# EasyEDA Pro project kod-01-akdk.eprj, board kod-01-panelized-pcb
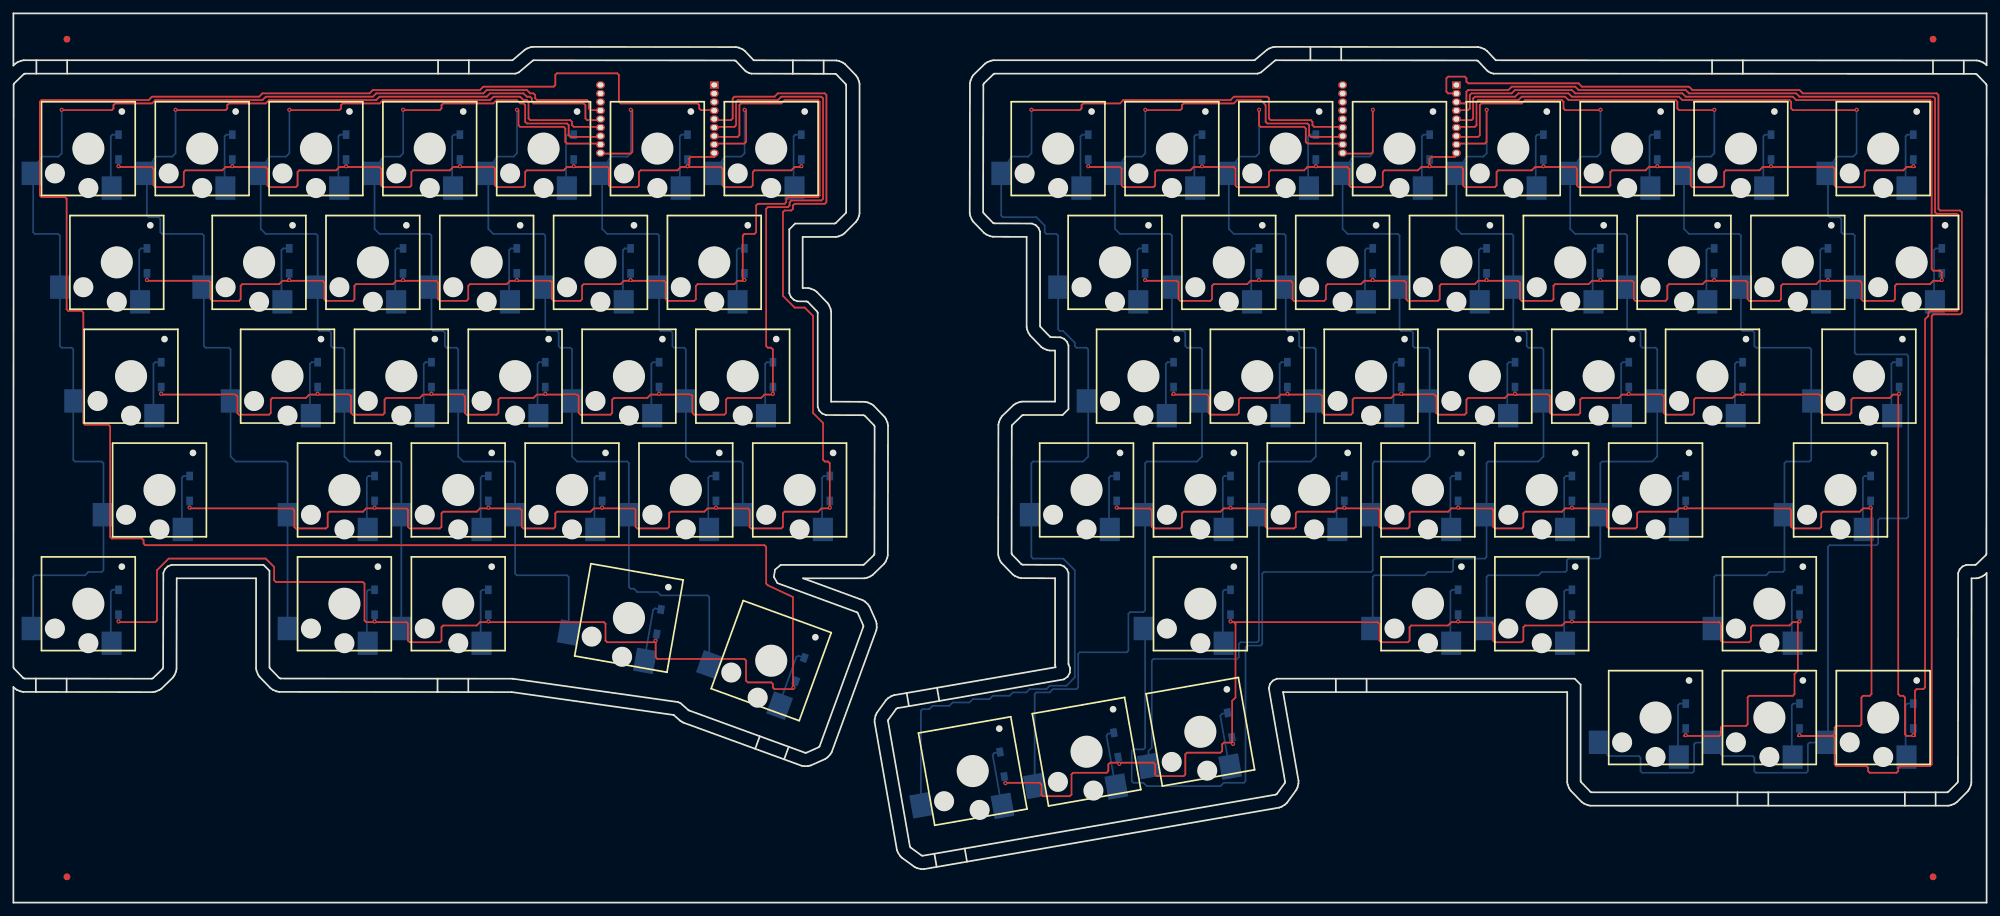
[diagram p4: board, top side]
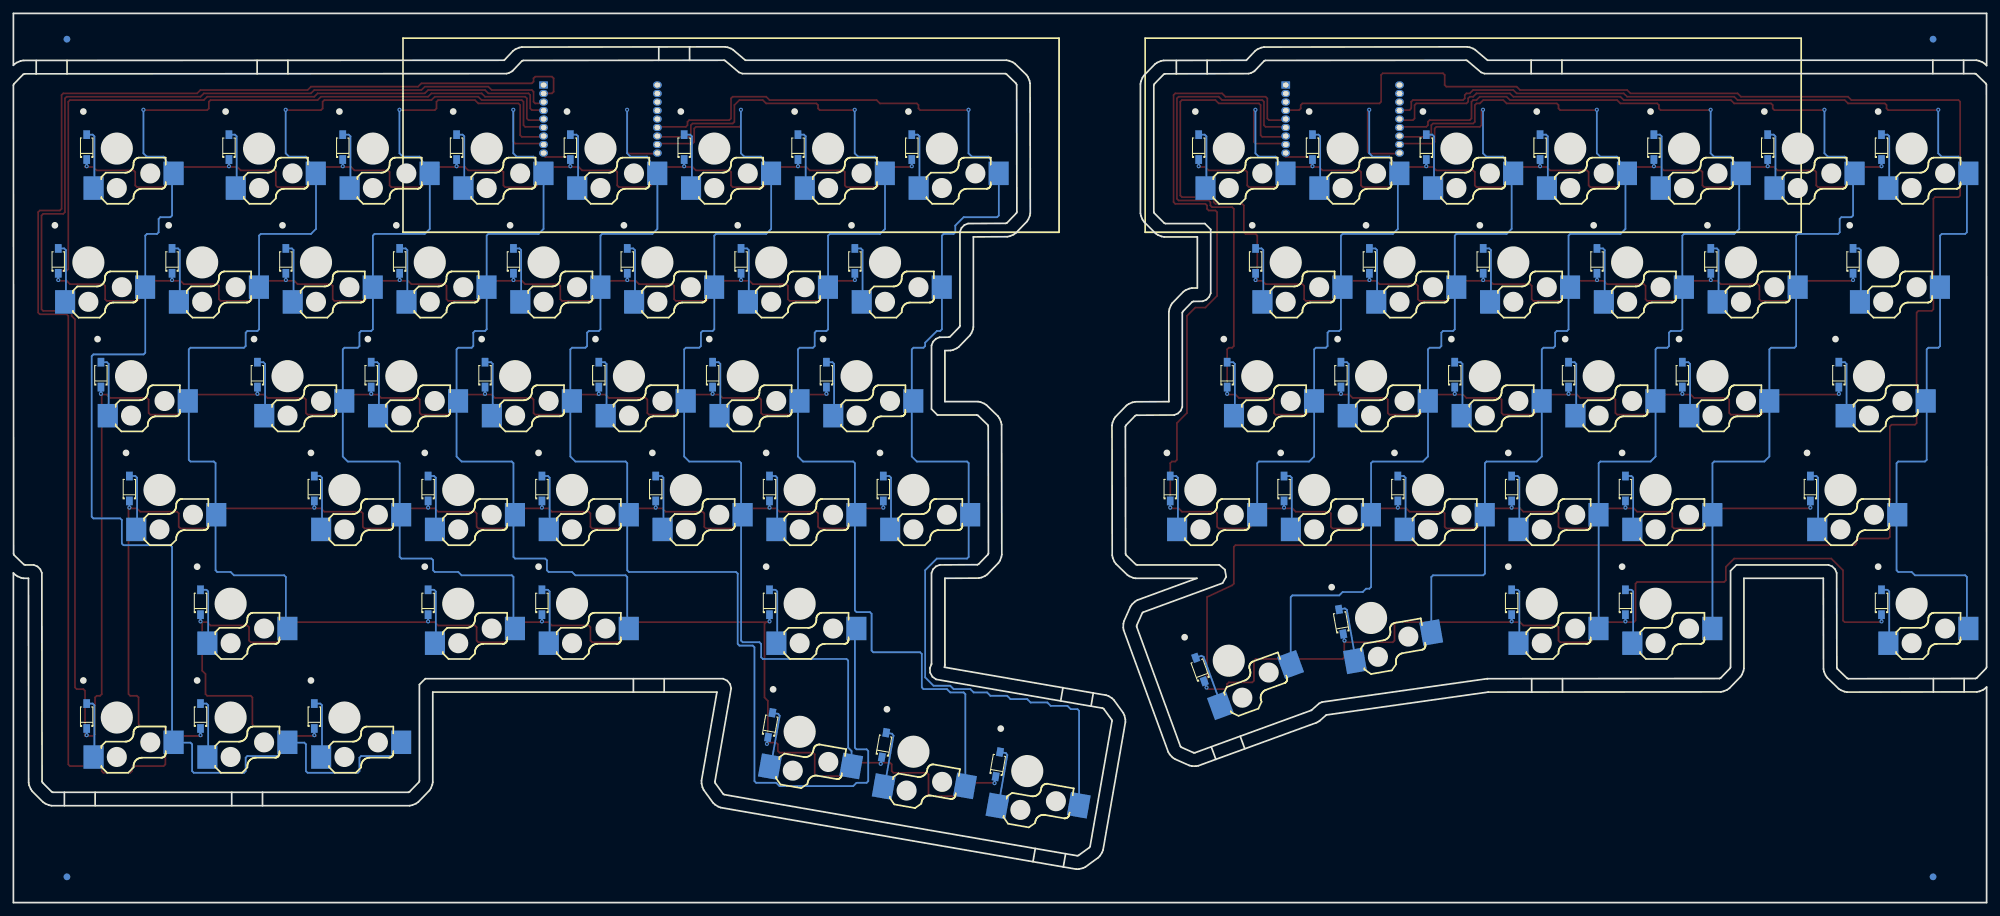
[diagram p5: board, bottom side, seen from below]

Outline 294.76 x 132.85 mm; copper layers: Top Layer, Bottom Layer. Coordinates in mm from the lower left corner of the outline.

## Design rules (mm)
spacing Default (default): track to track 0.152, other pairs 0 to 0.152
track width Default (default): min 0.254, default 0.254, max 25.4
via Default (default): diameter min 0.61, default 0.61, max 100.025; hole min 0.305, default 0.305, max 59.995

## Placement (name value [footprint] x y rotation side)
D1_L  -  [1N4148W]  15.7 112.85 90 bottom
D1_R  -  [1N4148W]  160.56 112.85 90 bottom
D2_L  -  [1N4148W]  32.7 112.85 90 bottom
D2_R  -  [1N4148W]  177.56 112.85 90 bottom
D3_L  -  [1N4148W]  49.7 112.85 90 bottom
D3_R  -  [1N4148W]  194.56 112.85 90 bottom
D4_L  -  [1N4148W]  66.7 112.85 90 bottom
D4_R  -  [1N4148W]  211.56 112.85 90 bottom
D5_L  -  [1N4148W]  83.7 112.85 90 bottom
D5_R  -  [1N4148W]  228.56 112.85 90 bottom
D6_L  -  [1N4148W]  100.7 112.85 90 bottom
D6_R  -  [1N4148W]  245.56 112.85 90 bottom
D7_L  -  [1N4148W]  117.7 112.85 90 bottom
D7_R  -  [1N4148W]  262.56 112.85 90 bottom
D8_L  -  [1N4148W]  19.95 95.85 90 bottom
D8_R  -  [1N4148W]  283.81 112.85 90 bottom
D9_L  -  [1N4148W]  41.2 95.85 90 bottom
D9_R  -  [1N4148W]  169.06 95.85 90 bottom
D10_L  -  [1N4148W]  58.2 95.85 90 bottom
D10_R  -  [1N4148W]  186.06 95.85 90 bottom
D11_L  -  [1N4148W]  75.2 95.85 90 bottom
D11_R  -  [1N4148W]  203.06 95.85 90 bottom
D12_L  -  [1N4148W]  92.2 95.85 90 bottom
D12_R  -  [1N4148W]  220.06 95.85 90 bottom
D13_L  -  [1N4148W]  109.2 95.85 90 bottom
D13_R  -  [1N4148W]  237.06 95.85 90 bottom
D14_L  -  [1N4148W]  22.08 78.85 90 bottom
D14_R  -  [1N4148W]  254.06 95.85 90 bottom
D15_L  -  [1N4148W]  45.45 78.85 90 bottom
D15_R  -  [1N4148W]  271.06 95.85 90 bottom
D16_L  -  [1N4148W]  62.45 78.85 90 bottom
D16_R  -  [1N4148W]  288.06 95.85 90 bottom
D17_L  -  [1N4148W]  79.45 78.85 90 bottom
D17_R  -  [1N4148W]  173.31 78.85 90 bottom
D18_L  -  [1N4148W]  96.45 78.85 90 bottom
D18_R  -  [1N4148W]  190.31 78.85 90 bottom
D19_L  -  [1N4148W]  113.45 78.85 90 bottom
D19_R  -  [1N4148W]  207.31 78.85 90 bottom
D20_L  -  [1N4148W]  26.33 61.85 90 bottom
D20_R  -  [1N4148W]  224.31 78.85 90 bottom
D21_L  -  [1N4148W]  53.95 61.85 90 bottom
D21_R  -  [1N4148W]  241.31 78.85 90 bottom
D22_L  -  [1N4148W]  70.95 61.85 90 bottom
D22_R  -  [1N4148W]  258.31 78.85 90 bottom
D23_L  -  [1N4148W]  87.95 61.85 90 bottom
D23_R  -  [1N4148W]  281.68 78.85 90 bottom
D24_L  -  [1N4148W]  104.95 61.85 90 bottom
D24_R  -  [1N4148W]  283.81 27.85 90 bottom
D25_L  -  [1N4148W]  121.95 61.85 90 bottom
D25_R  -  [1N4148W]  164.81 61.85 90 bottom
D26_L  -  [1N4148W]  15.7 44.85 90 bottom
D26_R  -  [1N4148W]  181.81 61.85 90 bottom
D27_L  -  [1N4148W]  53.95 44.85 90 bottom
D27_R  -  [1N4148W]  198.81 61.85 90 bottom
D28_L  -  [1N4148W]  70.95 44.85 90 bottom
D28_R  -  [1N4148W]  215.81 61.85 90 bottom
D29_L  -  [1N4148W#2]  96.42 41.94 100 bottom
D29_R  -  [1N4148W]  232.81 61.85 90 bottom
D30_L  -  [1N4148W#4]  117.5 34.8 110 bottom
D30_R  -  [1N4148W]  249.81 61.85 90 bottom
D31_R  -  [1N4148W]  277.43 61.85 90 bottom
D32_R  -  [1N4148W]  266.81 27.85 90 bottom
D33_R  -  [1N4148W#3]  147.7 20.64 80 bottom
D34_R  -  [1N4148W#3]  164.7 23.53 80 bottom
D35_R  -  [1N4148W#3]  181.7 26.5 80 bottom
D36_R  -  [1N4148W]  181.81 44.85 90 bottom
D37_R  -  [1N4148W]  215.81 44.85 90 bottom
D38_R  -  [1N4148W]  232.81 44.85 90 bottom
D39_R  -  [1N4148W]  266.81 44.85 90 bottom
D40_R  -  [1N4148W]  249.81 27.85 90 bottom
NOREF  -  [Pad_e1849]  286.76 3.85 0 top
NOREF#2  -  [Pad_e1843]  286.76 129 0 top
NOREF#3  -  [Pad_e1847]  286.76 129 0 top
NOREF#4  -  [Pad_e1848]  8 3.85 0 top
NOREF#5  -  [Pad_e1842]  8 129 0 top
NOREF#6  -  [Pad_e1844]  8 3.85 0 top
NOREF#7  -  [Pad_e1846]  8 129 0 top
NOREF#8  -  [Pad_e1845]  286.76 3.85 0 top
SW1_L  -  [CPG135001S30#2]  8.7 107.85 180 bottom
SW1_R  -  [CPG135001S30#2]  153.56 107.85 180 bottom
SW2_L  -  [CPG135001S30#2]  25.7 107.85 180 bottom
SW2_R  -  [CPG135001S30#2]  170.56 107.85 180 bottom
SW3_L  -  [CPG135001S30#2]  42.7 107.85 180 bottom
SW3_R  -  [CPG135001S30#2]  187.56 107.85 180 bottom
SW4_L  -  [CPG135001S30#2]  59.7 107.85 180 bottom
SW4_R  -  [CPG135001S30#2]  204.56 107.85 180 bottom
SW5_L  -  [CPG135001S30#2]  76.7 107.85 180 bottom
SW5_R  -  [CPG135001S30#2]  221.56 107.85 180 bottom
SW6_L  -  [CPG135001S30#2]  93.7 107.85 180 bottom
SW6_R  -  [CPG135001S30#2]  238.56 107.85 180 bottom
SW7_L  -  [CPG135001S30#2]  110.7 107.85 180 bottom
SW7_R  -  [CPG135001S30#2]  255.56 107.85 180 bottom
SW8_L  -  [CPG135001S30#2]  12.95 90.85 180 bottom
SW8_R  -  [CPG135001S30#2]  276.81 107.85 180 bottom
SW9_L  -  [CPG135001S30#2]  34.2 90.85 180 bottom
SW9_R  -  [CPG135001S30#2]  162.06 90.85 180 bottom
SW10_L  -  [CPG135001S30#2]  51.2 90.85 180 bottom
SW10_R  -  [CPG135001S30#2]  179.06 90.85 180 bottom
SW11_L  -  [CPG135001S30#2]  68.2 90.85 180 bottom
SW11_R  -  [CPG135001S30#2]  196.06 90.85 180 bottom
SW12_L  -  [CPG135001S30#2]  85.2 90.85 180 bottom
SW12_R  -  [CPG135001S30#2]  213.06 90.85 180 bottom
SW13_L  -  [CPG135001S30#2]  102.2 90.85 180 bottom
SW13_R  -  [CPG135001S30#2]  230.06 90.85 180 bottom
SW14_L  -  [CPG135001S30#2]  15.07 73.85 180 bottom
SW14_R  -  [CPG135001S30#2]  247.06 90.85 180 bottom
SW15_L  -  [CPG135001S30#2]  38.45 73.85 180 bottom
SW15_R  -  [CPG135001S30#2]  264.06 90.85 180 bottom
SW16_L  -  [CPG135001S30#2]  55.45 73.85 180 bottom
SW16_R  -  [CPG135001S30#2]  281.06 90.85 180 bottom
SW17_L  -  [CPG135001S30#2]  72.45 73.85 180 bottom
SW17_R  -  [CPG135001S30#2]  166.31 73.85 180 bottom
SW18_L  -  [CPG135001S30#2]  89.45 73.85 180 bottom
SW18_R  -  [CPG135001S30#2]  183.31 73.85 180 bottom
SW19_L  -  [CPG135001S30#2]  106.45 73.85 180 bottom
SW19_R  -  [CPG135001S30#2]  200.31 73.85 180 bottom
SW20_L  -  [CPG135001S30#2]  19.33 56.85 180 bottom
SW20_R  -  [CPG135001S30#2]  217.31 73.85 180 bottom
SW21_L  -  [CPG135001S30#2]  46.95 56.85 180 bottom
SW21_R  -  [CPG135001S30#2]  234.31 73.85 180 bottom
SW22_L  -  [CPG135001S30#2]  63.95 56.85 180 bottom
SW22_R  -  [CPG135001S30#2]  251.31 73.85 180 bottom
SW23_L  -  [CPG135001S30#2]  80.95 56.85 180 bottom
SW23_R  -  [CPG135001S30#2]  274.68 73.85 180 bottom
SW24_L  -  [CPG135001S30#2]  97.95 56.85 180 bottom
SW24_R  -  [CPG135001S30#2]  276.81 22.85 180 bottom
SW25_L  -  [CPG135001S30#2]  114.95 56.85 180 bottom
SW25_R  -  [CPG135001S30#2]  157.81 56.85 180 bottom
SW26_L  -  [CPG135001S30#2]  8.7 39.85 180 bottom
SW26_R  -  [CPG135001S30#2]  174.81 56.85 180 bottom
SW27_L  -  [CPG135001S30#2]  46.95 39.85 180 bottom
SW27_R  -  [CPG135001S30#2]  191.81 56.85 180 bottom
SW28_L  -  [CPG135001S30#2]  63.95 39.85 180 bottom
SW28_R  -  [CPG135001S30#2]  208.81 56.85 180 bottom
SW29_L  -  [CPG135001S30#3]  88.65 38.23 190 bottom
SW29_R  -  [CPG135001S30#2]  225.81 56.85 180 bottom
SW30_L  -  [CPG135001S30#4]  109.21 32.5 200 bottom
SW30_R  -  [CPG135001S30#2]  242.81 56.85 180 bottom
SW31_R  -  [CPG135001S30#2]  270.43 56.85 180 bottom
SW32_R  -  [CPG135001S30#2]  259.81 22.85 180 bottom
SW33_R  -  [CPG135001S30]  141.68 14.5 170 bottom
SW34_R  -  [CPG135001S30]  158.68 17.39 170 bottom
SW35_R  -  [CPG135001S30]  175.68 20.36 170 bottom
SW36_R  -  [CPG135001S30#2]  174.81 39.85 180 bottom
SW37_R  -  [CPG135001S30#2]  208.81 39.85 180 bottom
SW38_R  -  [CPG135001S30#2]  225.81 39.85 180 bottom
SW39_R  -  [CPG135001S30#2]  259.81 39.85 180 bottom
SW40_R  -  [CPG135001S30#2]  242.81 22.85 180 bottom
U1_L  -  [MS88SF2_1-1-3-SIDE2]  104.7 122.15 0 bottom
U1_R  -  [MS88SF2_1-1-3-SIDE2]  215.56 122.15 0 bottom

## Footprints (pads in the part's own frame, mm; a bottom-side part is the same pattern mirrored in y, then rotated)
1N4148W
  rect 1.3x1 smd: 1(-1.835,0) 2(1.884,0)
1N4148W#2
  rect 1.3x1 smd rot 160: 1(-1.724,-0.627) 2(1.77,0.644)
1N4148W#3
  rect 1.3x1 smd rot 20: 1(-1.724,0.627) 2(1.77,-0.644)
1N4148W#4
  rect 1.3x1 smd rot 140: 1(-1.405,-1.179) 2(1.443,1.211)
CPG135001S30
  rect 3x3.5 smd rot 20: 1(5.991,-1.01) 2(-5.991,1.01)
CPG135001S30#2
  rect 3x3.5 smd: 1(5.975,1.1) 2(-5.975,-1.1)
CPG135001S30#3
  rect 3x3.5 smd rot 160: 1(5.239,3.078) 2(-5.239,-3.078)
CPG135001S30#4
  rect 3x3.5 smd rot 140: 1(3.87,4.684) 2(-3.87,-4.684)
MS88SF2_1-1-3-SIDE2
  rect 1.3x1.07 hole 0.85x0.7: 1(0,0)
  oval 1.3x1.07 hole 0.85x0.7: 2(0,1.27) 3(0,2.54) 4(0,3.81) 5(0,5.08) 6(0,6.35) 7(0,7.62) 8(0,8.89) 9(0,10.16) 10(-17,10.16) 11(-17,8.89) 12(-17,7.62) 13(-17,6.35) 14(-17,5.08) 15(-17,3.81) 16(-17,2.54) 17(-17,1.27) 18(-17,0)
Pad_e1842
  round 1 smd: 0(0,0)
Pad_e1843
  round 1 smd: 0(0,0)
Pad_e1844
  round 1 smd: 0(0,0)
Pad_e1845
  round 1 smd: 0(0,0)
Pad_e1846
  round 1 smd far side: 0(0,0)
Pad_e1847
  round 1 smd far side: 0(0,0)
Pad_e1848
  round 1 smd far side: 0(0,0)
Pad_e1849
  round 1 smd far side: 0(0,0)

## Nets
COL0_L: SW1_L.1 SW8_L.1 SW14_L.1 SW20_L.1 SW26_L.1 U1_L.15
COL0_R: SW1_R.1 SW9_R.1 SW17_R.1 SW25_R.1 SW33_R.1 U1_R.13
COL1_L: SW2_L.1 SW9_L.1 SW15_L.1 SW21_L.1 SW27_L.1 U1_L.14
COL1_R: SW2_R.1 SW10_R.1 SW18_R.1 SW26_R.1 SW34_R.1 U1_R.12
COL2_L: SW3_L.1 SW10_L.1 SW16_L.1 SW22_L.1 SW28_L.1 U1_L.13
COL2_R: SW3_R.1 SW11_R.1 SW19_R.1 SW27_R.1 SW35_R.1 U1_R.11
COL3_L: SW4_L.1 SW11_L.1 SW17_L.1 SW23_L.1 SW29_L.1 U1_L.12
COL3_R: SW4_R.1 SW12_R.1 SW20_R.1 SW28_R.1 SW36_R.1 U1_R.10
COL4_L: SW5_L.1 SW12_L.1 SW18_L.1 SW24_L.1 SW30_L.1 U1_L.11
COL4_R: SW5_R.1 SW13_R.1 SW21_R.1 SW29_R.1 SW37_R.1 U1_R.8
COL5_L: SW6_L.1 SW13_L.1 SW19_L.1 SW25_L.1 U1_L.10
COL5_R: SW6_R.1 SW14_R.1 SW22_R.1 SW30_R.1 SW38_R.1 U1_R.7
COL6_L: SW7_L.1 U1_L.8
COL6_R: SW7_R.1 SW15_R.1 SW23_R.1 SW31_R.1 SW39_R.1 U1_R.6
COL7_R: SW8_R.1 SW16_R.1 SW24_R.1 SW32_R.1 SW40_R.1 U1_R.5
ROW0_L: D1_L.1 D2_L.1 D3_L.1 D4_L.1 D5_L.1 D6_L.1 D7_L.1 U1_L.9
ROW0_R: D1_R.1 D2_R.1 D3_R.1 D4_R.1 D5_R.1 D6_R.1 D7_R.1 D8_R.1 U1_R.9
ROW1_L: D8_L.1 D9_L.1 D10_L.1 D11_L.1 D12_L.1 D13_L.1 U1_L.7
ROW1_R: D9_R.1 D10_R.1 D11_R.1 D12_R.1 D13_R.1 D14_R.1 D15_R.1 D16_R.1 U1_R.4
ROW2_L: D14_L.1 D15_L.1 D16_L.1 D17_L.1 D18_L.1 D19_L.1 U1_L.6
ROW2_R: D17_R.1 D18_R.1 D19_R.1 D20_R.1 D21_R.1 D22_R.1 D23_R.1 D24_R.1 U1_R.3
ROW3_L: D20_L.1 D21_L.1 D22_L.1 D23_L.1 D24_L.1 D25_L.1 U1_L.5
ROW3_R: D25_R.1 D26_R.1 D27_R.1 D28_R.1 D29_R.1 D30_R.1 D31_R.1 D32_R.1 U1_R.2
ROW4_L: D26_L.1 D27_L.1 D28_L.1 D29_L.1 D30_L.1 U1_L.4
ROW4_R: D33_R.1 D34_R.1 D35_R.1 D36_R.1 D37_R.1 D38_R.1 D39_R.1 D40_R.1 U1_R.1
SW1_2_L: D1_L.2 SW1_L.2
SW1_2_R: D1_R.2 SW1_R.2
SW2_2_L: D2_L.2 SW2_L.2
SW2_2_R: D2_R.2 SW2_R.2
SW3_2_L: D3_L.2 SW3_L.2
SW3_2_R: D3_R.2 SW3_R.2
SW4_2_L: D4_L.2 SW4_L.2
SW4_2_R: D4_R.2 SW4_R.2
SW5_2_L: D5_L.2 SW5_L.2
SW5_2_R: D5_R.2 SW5_R.2
SW6_2_L: D6_L.2 SW6_L.2
SW6_2_R: D6_R.2 SW6_R.2
SW7_2_L: D7_L.2 SW7_L.2
SW7_2_R: D7_R.2 SW7_R.2
SW8_2_L: D8_L.2 SW8_L.2
SW8_2_R: D8_R.2 SW8_R.2
SW9_2_L: D9_L.2 SW9_L.2
SW9_2_R: D9_R.2 SW9_R.2
SW10_2_L: D10_L.2 SW10_L.2
SW10_2_R: D10_R.2 SW10_R.2
SW11_2_L: D11_L.2 SW11_L.2
SW11_2_R: D11_R.2 SW11_R.2
SW12_2_L: D12_L.2 SW12_L.2
SW12_2_R: D12_R.2 SW12_R.2
SW13_2_L: D13_L.2 SW13_L.2
SW13_2_R: D13_R.2 SW13_R.2
SW14_2_L: D14_L.2 SW14_L.2
SW14_2_R: D14_R.2 SW14_R.2
SW15_2_L: D15_L.2 SW15_L.2
SW15_2_R: D15_R.2 SW15_R.2
SW16_2_L: D16_L.2 SW16_L.2
SW16_2_R: D16_R.2 SW16_R.2
SW17_2_L: D17_L.2 SW17_L.2
SW17_2_R: D17_R.2 SW17_R.2
SW18_2_L: D18_L.2 SW18_L.2
SW18_2_R: D18_R.2 SW18_R.2
SW19_2_L: D19_L.2 SW19_L.2
SW19_2_R: D19_R.2 SW19_R.2
SW20_2_L: D20_L.2 SW20_L.2
SW20_2_R: D20_R.2 SW20_R.2
SW21_2_L: D21_L.2 SW21_L.2
SW21_2_R: D21_R.2 SW21_R.2
SW22_2_L: D22_L.2 SW22_L.2
SW22_2_R: D22_R.2 SW22_R.2
SW23_2_L: D23_L.2 SW23_L.2
SW23_2_R: D23_R.2 SW23_R.2
SW24_2_L: D24_L.2 SW24_L.2
SW24_2_R: D24_R.2 SW24_R.2
SW25_2_L: D25_L.2 SW25_L.2
SW25_2_R: D25_R.2 SW25_R.2
SW26_2_L: D26_L.2 SW26_L.2
SW26_2_R: D26_R.2 SW26_R.2
SW27_2_L: D27_L.2 SW27_L.2
SW27_2_R: D27_R.2 SW27_R.2
SW28_2_L: D28_L.2 SW28_L.2
SW28_2_R: D28_R.2 SW28_R.2
SW29_2_L: D29_L.2 SW29_L.2
SW29_2_R: D29_R.2 SW29_R.2
SW30_2_L: D30_L.2 SW30_L.2
SW30_2_R: D30_R.2 SW30_R.2
SW31_2_R: D31_R.2 SW31_R.2
SW32_2_R: D32_R.2 SW32_R.2
SW33_2_R: D33_R.2 SW33_R.2
SW34_2_R: D34_R.2 SW34_R.2
SW35_2_R: D35_R.2 SW35_R.2
SW36_2_R: D36_R.2 SW36_R.2
SW37_2_R: D37_R.2 SW37_R.2
SW38_2_R: D38_R.2 SW38_R.2
SW39_2_R: D39_R.2 SW39_R.2
SW40_2_R: D40_R.2 SW40_R.2

Pads without a net: NOREF 0; NOREF#2 0; NOREF#3 0; NOREF#4 0; NOREF#5 0; NOREF#6 0; NOREF#7 0; NOREF#8 0; U1_L 1 2 3 16 17 18; U1_R 14 15 16 17 18

## Via types
v1: diameter 0.61, hole 0.305, Top Layer to Bottom Layer, 85 vias

## Routing (per net, layer and track width the routed paths; a pad name or vN(x,y) marks a point on that pad's centre or on a via; arc(x,y) is an arc through that point)
COL0_L: length 185.9
  Top Layer w0.254: v1(7.22,118.45) 7.45,118.4 14.7,118.4 14.95,118.65 14.95,119.15 15.2,119.4 20.7,119.4 21.2,119.9 37.2,119.9 37.7,120.4 53.7,120.4 54.2,120.9 70.2,120.9 70.7,121.4 76.7,121.4 77.2,120.9 77.7,120.9 77.95,120.65 77.95,120.15 78.2,119.9 85.7,119.9 85.95,119.65 85.95,118.65 86.2,118.4 87.95,118.4 U1_L.15
  Bottom Layer w0.254: 13.45,57.9 SW20_L.1 13.45,57.9 ; 13.45,57.9 13.45,49.65 13.2,49.4 11.2,49.4 10.7,48.9 3.2,48.9 2.95,48.65 2.95,40.9 2.72,40.95 ; 13.45,57.9 13.45,65.65 13.2,65.9 9.2,65.9 8.95,66.15 8.95,74.9 ; 8.95,74.9 SW14_L.1 8.95,74.9 ; 8.95,74.9 8.95,82.65 8.7,82.9 7.2,82.9 6.95,83.15 6.95,91.9 ; 6.95,91.9 SW8_L.1 6.95,91.9 ; 6.95,91.9 6.95,99.65 6.7,99.9 3.2,99.9 2.95,100.15 2.95,108.9 2.72,108.95 4.22,111.45 6.72,111.45 7.22,111.95 v1(7.22,118.45)
COL0_R: length 203.7
  Top Layer w0.254: U1_R.13 198.56,115.9 194.31,115.9 194.06,116.15 194.06,116.65 193.81,116.9 187.81,116.9 187.56,117.15 187.56,120.15 187.31,120.4 182.31,120.4 181.81,119.9 165.81,119.9 165.31,119.4 159.81,119.4 159.56,119.15 159.56,118.65 159.31,118.4 152.06,118.4 v1(152.08,118.45)
  Bottom Layer w0.254: 160.56,74.9 160.56,82.65 160.31,82.9 158.81,82.9 158.56,83.15 158.56,83.65 156.81,85.4 156.31,85.4 156.06,85.65 156.06,91.9 ; 160.56,74.9 SW17_R.1 160.56,74.9 ; 160.56,74.9 160.56,66.65 159.81,65.9 152.31,65.9 152.06,65.65 152.06,57.9 ; 156.06,91.9 SW9_R.1 156.06,91.9 ; 156.06,91.9 156.06,99.65 155.81,99.9 154.31,99.9 154.06,100.15 154.06,101.15 152.81,102.4 147.81,102.4 147.56,102.65 147.56,108.9 SW1_R.1 149.08,111.45 151.58,111.45 152.08,111.95 v1(152.08,118.45) ; SW33_R.1 135.56,14.4 135.56,28.65 135.81,28.9 136.81,28.9 137.31,29.4 139.81,29.4 140.31,29.9 142.81,29.9 143.31,30.4 145.81,30.4 146.31,30.9 148.81,30.9 149.31,31.4 151.31,31.4 151.81,31.9 154.31,31.9 154.81,32.4 157.31,32.4 158.56,33.65 158.56,49.65 156.81,51.4 152.31,51.4 152.06,51.65 152.06,57.9 ; 152.06,57.9 SW25_R.1 152.06,57.9
COL1_L: length 169.6
  Top Layer w0.254: U1_L.14 87.95,116.9 85.7,116.9 85.45,117.15 85.45,119.15 85.2,119.4 77.7,119.4 77.45,119.65 77.45,120.15 77.2,120.4 76.7,120.4 76.2,120.9 71.2,120.9 70.7,120.4 54.7,120.4 54.2,119.9 38.2,119.9 37.7,119.4 32.2,119.4 31.95,119.15 31.95,118.65 31.7,118.4 24.45,118.4 v1(24.23,118.45)
  Bottom Layer w0.254: v1(24.23,118.45) 24.23,111.95 23.73,111.45 21.23,111.45 SW2_L.1 19.95,108.9 19.95,102.65 20.2,102.4 21.7,102.4 21.95,102.15 21.95,100.15 22.2,99.9 28.2,99.9 28.45,99.65 28.45,91.9 ; 32.45,74.9 32.45,66.65 33.2,65.9 40.7,65.9 40.95,65.65 40.95,57.9 ; 32.45,74.9 SW15_L.1 32.45,74.9 ; 32.45,74.9 32.45,82.65 32.2,82.9 28.7,82.9 28.45,83.15 28.45,91.9 ; 40.95,57.9 40.95,40.9 SW27_L.1 ; 40.95,57.9 SW21_L.1 40.95,57.9 ; 28.45,91.9 SW9_L.1 28.45,91.9
COL1_R: length 175.6
  Top Layer w0.254: U1_R.12 198.56,114.4 193.81,114.4 193.56,114.65 193.56,116.15 193.31,116.4 187.31,116.4 187.06,116.65 187.06,119.15 186.31,119.9 182.81,119.9 182.31,119.4 174.81,119.4 174.56,119.15 174.56,118.65 174.31,118.4 169.06,118.4 v1(169.08,118.45)
  Bottom Layer w0.254: 177.56,74.9 177.56,66.65 176.81,65.9 169.31,65.9 169.06,65.65 169.06,57.9 ; 177.56,74.9 177.56,82.65 177.31,82.9 175.31,82.9 175.06,83.15 175.06,85.15 174.81,85.4 173.31,85.4 173.06,85.65 173.06,91.9 ; 177.56,74.9 SW18_R.1 177.56,74.9 ; v1(169.08,118.45) 169.08,111.95 168.58,111.45 166.08,111.45 SW2_R.1 164.56,108.9 164.56,100.65 165.31,99.9 172.81,99.9 173.06,99.65 173.06,91.9 ; 173.06,91.9 SW10_R.1 173.06,91.9 ; 169.06,57.9 169.06,43.65 168.81,43.4 166.81,43.4 166.56,43.15 166.56,37.65 166.31,37.4 159.31,37.4 159.06,37.15 159.06,32.15 158.81,31.9 155.31,31.9 154.81,31.4 152.81,31.4 152.56,31.15 152.56,17.4 SW34_R.1 ; 169.06,57.9 SW26_R.1 169.06,57.9
COL2_L: length 152.6
  Top Layer w0.254: U1_L.13 87.95,115.9 83.7,115.9 83.45,116.15 83.45,116.65 83.2,116.9 77.2,116.9 76.95,117.15 76.95,119.65 76.7,119.9 76.2,119.9 75.7,120.4 71.7,120.4 71.2,119.9 55.2,119.9 54.7,119.4 49.2,119.4 48.95,119.15 48.95,118.65 48.7,118.4 41.45,118.4 v1(41.23,118.45)
  Bottom Layer w0.254: 57.95,57.9 57.95,40.9 SW28_L.1 ; 57.95,57.9 SW22_L.1 57.95,57.9 ; 57.95,57.9 57.95,65.65 57.7,65.9 50.2,65.9 49.45,66.65 49.45,74.9 ; 45.45,91.9 SW10_L.1 45.45,91.9 ; 45.45,91.9 45.45,99.65 45.2,99.9 37.7,99.9 36.95,100.65 36.95,108.9 SW3_L.1 38.23,111.45 40.73,111.45 41.23,111.95 v1(41.23,118.45) ; 45.45,91.9 45.45,85.65 45.7,85.4 47.2,85.4 47.45,85.15 47.45,83.15 47.7,82.9 49.2,82.9 49.45,82.65 49.45,74.9 ; 49.45,74.9 SW16_L.1 49.45,74.9
COL2_R: length 154.9
  Top Layer w0.254: U1_R.11 198.56,113.4 193.31,113.4 193.06,113.65 193.06,115.65 192.81,115.9 186.31,115.9 186.06,116.15 186.06,118.4 v1(186.08,118.45)
  Bottom Layer w0.254: 186.06,57.9 186.06,39.15 185.81,38.9 183.31,38.9 183.06,38.65 183.06,36.65 182.81,36.4 170.31,36.4 170.06,36.15 170.06,23.15 169.56,22.65 169.56,20.4 SW35_R.1 ; 186.06,57.9 SW27_R.1 186.06,57.9 ; 186.06,57.9 186.06,65.65 186.31,65.9 193.81,65.9 194.56,66.65 194.56,74.9 ; 190.06,91.9 190.06,85.65 190.31,85.4 191.81,85.4 192.06,85.15 192.06,83.15 192.31,82.9 194.31,82.9 194.56,82.65 194.56,74.9 ; 190.06,91.9 190.06,99.65 189.81,99.9 182.31,99.9 181.56,100.65 181.56,108.9 SW3_R.1 183.08,111.45 185.58,111.45 186.08,111.95 v1(186.08,118.45) ; 190.06,91.9 SW11_R.1 190.06,91.9 ; 194.56,74.9 SW19_R.1 194.56,74.9
COL3_L: length 144.6
  Top Layer w0.254: U1_L.12 87.95,114.4 83.2,114.4 82.95,114.65 82.95,116.15 82.7,116.4 76.7,116.4 76.45,116.65 76.45,119.15 76.2,119.4 75.7,119.4 75.2,119.9 72.2,119.9 71.7,119.4 64.2,119.4 63.95,119.15 63.95,118.65 63.7,118.4 58.45,118.4 v1(58.23,118.45)
  Bottom Layer w0.254: 74.95,57.9 SW23_L.1 74.95,57.9 ; 74.95,57.9 74.95,65.65 74.7,65.9 67.2,65.9 66.45,66.65 66.45,74.9 ; 74.95,57.9 74.95,49.15 75.2,48.9 82.7,48.9 82.95,48.65 82.95,40.4 82.96,40.35 ; 62.45,91.9 62.45,99.65 62.2,99.9 54.7,99.9 53.95,100.65 53.95,108.9 SW4_L.1 55.23,111.45 57.73,111.45 58.23,111.95 v1(58.23,118.45) ; 62.45,91.9 SW11_L.1 62.45,91.9 ; 62.45,91.9 62.45,85.65 62.7,85.4 64.2,85.4 64.45,85.15 64.45,83.15 64.7,82.9 66.2,82.9 66.45,82.65 66.45,74.9 ; 66.45,74.9 66.47,74.95 66.45,74.9
COL3_R: length 195.9
  Top Layer w0.254: v1(203.08,118.45) 203.06,118.4 203.06,112.15 202.81,111.9 198.56,111.9 U1_R.10
  Bottom Layer w0.254: 203.06,57.9 SW28_R.1 203.06,57.9 ; 203.06,57.9 203.06,65.65 203.31,65.9 210.81,65.9 211.56,66.65 211.56,74.9 ; 203.06,57.9 203.06,49.65 202.81,49.4 186.81,49.4 186.56,49.15 186.56,38.65 186.31,38.4 184.31,38.4 184.06,38.15 184.06,18.15 183.81,17.9 180.81,17.9 180.31,17.4 169.31,17.4 168.81,17.9 167.31,17.9 167.06,18.15 167.06,22.65 167.31,22.9 168.81,22.9 169.06,23.15 169.06,40.9 SW36_R.1 ; 207.06,91.9 SW12_R.1 207.06,91.9 ; 207.06,91.9 207.06,99.65 206.81,99.9 199.31,99.9 198.56,100.65 198.56,108.9 SW4_R.1 200.08,111.45 202.58,111.45 203.08,111.95 v1(203.08,118.45) ; 207.06,91.9 207.06,85.65 207.31,85.4 208.81,85.4 209.06,85.15 209.06,83.15 209.31,82.9 211.31,82.9 211.56,82.65 211.56,74.9 ; 211.56,74.9 SW20_R.1 211.56,74.9
COL4_L: length 135.2
  Top Layer w0.254: U1_L.11 87.95,113.4 82.7,113.4 82.45,113.65 82.45,115.65 82.2,115.9 75.7,115.9 75.45,116.15 75.45,118.4 v1(75.22,118.45)
  Bottom Layer w0.254: 91.95,57.9 SW24_L.1 91.95,57.9 ; 91.95,57.9 91.95,47.15 92.2,46.9 92.7,46.9 93.2,46.4 96.2,46.4 96.7,45.9 103.7,45.9 103.95,45.65 103.95,35.4 SW30_L.1 ; 91.95,57.9 91.95,65.65 91.7,65.9 84.2,65.9 83.45,66.65 83.45,74.9 ; 83.45,74.9 SW18_L.1 83.45,74.9 ; 83.45,74.9 83.45,82.65 83.2,82.9 81.7,82.9 81.45,83.15 81.45,85.15 81.2,85.4 79.7,85.4 79.45,85.65 79.45,91.9 ; 79.45,91.9 79.22,91.95 79.45,91.9 ; 79.45,91.9 79.45,99.65 79.2,99.9 71.7,99.9 70.95,100.65 70.95,108.9 70.72,108.95 72.22,111.45 74.72,111.45 75.22,111.95 v1(75.22,118.45)
COL4_R: length 127.4
  Top Layer w0.254: v1(220.08,118.45) 220.06,118.4 220.06,113.65 219.81,113.4 215.56,113.4 U1_R.8
  Bottom Layer w0.254: 220.06,57.9 SW29_R.1 220.06,57.9 ; 220.06,57.9 220.06,65.65 220.31,65.9 227.81,65.9 228.56,66.65 228.56,74.9 ; 220.06,57.9 220.06,51.65 219.81,51.4 215.31,51.4 215.06,51.15 215.06,49.65 214.81,49.4 211.31,49.4 210.81,48.9 203.31,48.9 203.06,48.65 203.06,40.9 SW37_R.1 ; 228.56,74.9 SW21_R.1 228.56,74.9 ; 228.56,74.9 228.56,82.65 228.31,82.9 226.31,82.9 226.06,83.15 226.06,85.15 225.81,85.4 224.31,85.4 224.06,85.65 224.06,91.9 ; 224.06,91.9 SW13_R.1 224.06,91.9 ; 224.06,91.9 224.06,99.65 223.81,99.9 216.31,99.9 215.56,100.65 215.56,108.9 SW5_R.1 217.08,111.45 219.58,111.45 220.08,111.95 v1(220.08,118.45)
COL5_L: length 95.1
  Top Layer w0.254: U1_L.10 87.95,111.9 92.2,111.9 92.45,112.15 92.45,118.4 v1(92.22,118.45)
  Bottom Layer w0.254: 100.45,74.9 100.45,66.65 101.2,65.9 108.7,65.9 108.95,65.65 108.95,57.9 SW25_L.1 ; 100.45,74.9 100.45,82.65 100.2,82.9 98.7,82.9 98.45,83.15 98.45,85.15 98.2,85.4 96.7,85.4 96.45,85.65 96.45,91.9 ; 100.45,74.9 SW19_L.1 100.45,74.9 ; 96.45,91.9 96.45,99.65 96.2,99.9 88.7,99.9 87.95,100.65 87.95,108.9 87.72,108.95 89.22,111.45 91.72,111.45 92.22,111.95 v1(92.22,118.45) ; 96.45,91.9 96.22,91.95 96.45,91.9
COL5_R: length 145.6
  Top Layer w0.254: v1(237.08,118.45) 237.06,118.4 231.81,118.4 231.56,118.65 231.56,119.65 231.31,119.9 225.81,119.9 225.31,119.4 219.31,119.4 219.06,119.15 219.06,114.65 218.81,114.4 215.56,114.4 U1_R.7
  Bottom Layer w0.254: 241.06,91.9 241.06,85.65 241.31,85.4 242.81,85.4 243.06,85.15 243.06,83.15 243.31,82.9 245.31,82.9 245.56,82.65 245.56,74.9 ; 241.06,91.9 241.06,99.65 240.81,99.9 233.31,99.9 232.56,100.65 232.56,108.9 SW6_R.1 234.08,111.45 236.58,111.45 237.08,111.95 v1(237.08,118.45) ; 241.06,91.9 SW14_R.1 241.06,91.9 ; SW38_R.1 220.06,40.9 220.06,48.65 220.31,48.9 227.81,48.9 228.31,49.4 231.81,49.4 232.06,49.65 232.06,51.15 232.31,51.4 236.81,51.4 237.06,51.65 237.06,57.9 ; 237.06,57.9 SW30_R.1 237.06,57.9 ; 237.06,57.9 237.06,65.65 237.31,65.9 244.81,65.9 245.56,66.65 245.56,74.9 ; 245.56,74.9 SW22_R.1 245.56,74.9
COL6_L: length 22.5
  Top Layer w0.254: U1_L.8 104.95,113.4 109.2,113.4 109.45,113.65 109.45,118.4 v1(109.22,118.45)
  Bottom Layer w0.254: v1(109.22,118.45) 109.22,111.95 108.72,111.45 106.22,111.45 104.72,108.95
COL6_R: length 157
  Top Layer w0.254: U1_R.6 215.56,115.9 218.31,115.9 218.56,116.15 218.56,119.65 218.81,119.9 224.81,119.9 225.31,120.4 231.81,120.4 232.31,119.9 248.31,119.9 248.56,119.65 248.56,118.65 248.81,118.4 254.06,118.4 v1(254.08,118.45)
  Bottom Layer w0.254: 268.56,74.9 SW23_R.1 268.56,74.9 ; 268.56,74.9 268.56,66.15 268.31,65.9 264.81,65.9 264.56,65.65 264.56,57.9 ; 268.56,74.9 268.56,82.65 268.31,82.9 260.31,82.9 260.06,83.15 260.06,85.15 259.81,85.4 258.31,85.4 258.06,85.65 258.06,91.9 ; 258.06,91.9 258.06,99.65 257.81,99.9 250.31,99.9 249.56,100.65 249.56,108.9 SW7_R.1 251.08,111.45 253.58,111.45 254.08,111.95 v1(254.08,118.45) ; 258.06,91.9 SW15_R.1 258.06,91.9 ; SW39_R.1 254.06,40.9 254.06,48.65 254.31,48.9 261.81,48.9 262.31,49.4 264.31,49.4 264.56,49.65 264.56,57.9 ; 264.56,57.9 SW31_R.1 264.56,57.9
COL7_R: length 237.3
  Top Layer w0.254: v1(275.33,118.45) 275.56,118.4 265.81,118.4 265.56,118.65 265.56,119.65 265.31,119.9 249.31,119.9 248.81,120.4 232.81,120.4 232.31,120.9 224.81,120.9 224.31,120.4 218.31,120.4 218.06,120.15 218.06,117.15 217.81,116.9 215.56,116.9 U1_R.5
  Bottom Layer w0.254: 254.06,23.9 SW32_R.1 254.06,23.9 ; 254.06,23.9 254.81,23.9 255.06,23.65 255.06,22.15 255.31,21.9 259.81,21.9 260.06,21.65 260.06,19.65 260.31,19.4 267.81,19.4 268.06,19.65 268.06,23.65 268.31,23.9 271.06,23.9 ; 254.06,23.9 251.31,23.9 251.06,23.65 251.06,19.65 250.81,19.4 243.31,19.4 243.06,19.65 243.06,21.65 242.81,21.9 238.31,21.9 238.06,22.15 238.06,23.65 237.81,23.9 237.06,23.9 SW40_R.1 ; 271.06,23.9 SW24_R.1 271.06,23.9 ; 271.06,23.9 271.06,53.15 271.31,53.4 278.31,53.4 278.56,53.65 278.56,57.15 278.81,57.4 282.81,57.4 283.06,57.65 283.06,81.65 282.81,81.9 275.31,81.9 275.06,82.15 275.06,91.9 ; 275.06,91.9 SW16_R.1 275.06,91.9 ; 275.06,91.9 275.06,99.65 274.81,99.9 273.31,99.9 273.06,100.15 273.06,102.15 272.81,102.4 271.31,102.4 271.06,102.65 271.06,108.9 SW8_R.1 272.33,111.45 274.83,111.45 275.33,111.95 v1(275.33,118.45)
ROW0_L: length 148.8
  Top Layer w0.254: 83.95,109.9 88.7,109.9 88.95,109.65 88.95,107.15 89.2,106.9 93.2,106.9 93.45,107.15 93.45,109.15 93.7,109.4 99.2,109.4 99.7,109.9 100.95,109.9 ; 83.95,109.9 82.7,109.9 82.2,109.4 76.7,109.4 76.45,109.15 76.45,107.15 76.2,106.9 72.2,106.9 71.95,107.15 71.95,109.65 71.7,109.9 66.95,109.9 ; 83.95,109.9 v1(83.7,110.02) 83.95,109.9 ; v1(100.7,110.02) 100.95,109.9 ; v1(100.7,110.02) 100.95,109.9 ; v1(100.7,110.02) 100.95,109.9 ; 100.95,109.9 105.7,109.9 105.95,109.65 105.95,107.15 106.2,106.9 110.2,106.9 110.45,107.15 110.45,109.15 110.7,109.4 116.2,109.4 116.7,109.9 117.45,109.9 v1(117.7,110.02) ; 100.95,109.9 100.95,111.15 101.2,111.4 104.7,111.4 104.95,111.65 104.95,111.9 U1_L.9 ; 49.95,109.9 v1(49.7,110.02) 49.95,109.9 ; 49.95,109.9 48.7,109.9 48.2,109.4 42.7,109.4 42.45,109.15 42.45,107.15 42.2,106.9 38.2,106.9 37.95,107.15 37.95,109.65 37.7,109.9 32.95,109.9 ; 49.95,109.9 54.7,109.9 54.95,109.65 54.95,107.15 55.2,106.9 59.2,106.9 59.45,107.15 59.45,109.15 59.7,109.4 65.2,109.4 65.7,109.9 66.95,109.9 ; 32.95,109.9 31.7,109.9 31.2,109.4 25.7,109.4 25.45,109.15 25.45,107.15 25.2,106.9 21.2,106.9 20.95,107.15 20.95,109.65 20.7,109.9 15.95,109.9 v1(15.7,110.02) ; 32.95,109.9 v1(32.7,110.02) 32.95,109.9 ; 66.95,109.9 v1(66.7,110.02) 66.95,109.9
  Bottom Layer w0.254: D3_L.1 v1(49.7,110.02) ; D7_L.1 v1(117.7,110.02) ; D5_L.1 v1(83.7,110.02) ; D4_L.1 v1(66.7,110.02) ; D6_L.1 v1(100.7,110.02) ; D1_L.1 v1(15.7,110.02) ; D2_L.1 v1(32.7,110.02)
ROW0_R: length 175
  Top Layer w0.254: 211.56,109.9 v1(211.56,110.02) ; 211.56,109.9 v1(211.56,110.02) ; 211.56,109.9 v1(211.56,110.02) ; 211.56,109.9 216.31,109.9 216.56,109.65 216.56,107.15 216.81,106.9 221.31,106.9 221.56,107.15 221.56,109.15 221.81,109.4 226.81,109.4 227.31,109.9 228.56,109.9 ; 211.56,109.9 210.31,109.9 209.81,109.4 204.81,109.4 204.56,109.15 204.56,107.15 204.31,106.9 199.81,106.9 199.56,107.15 199.56,109.65 199.31,109.9 194.56,109.9 ; 211.56,109.9 211.56,111.15 211.81,111.4 215.31,111.4 215.56,111.65 U1_R.9 ; 245.56,109.9 v1(245.56,110.02) 245.56,109.9 ; 245.56,109.9 250.31,109.9 250.56,109.65 250.56,107.15 250.81,106.9 255.31,106.9 255.56,107.15 255.56,109.15 255.81,109.4 260.81,109.4 261.31,109.9 262.56,109.9 ; 245.56,109.9 244.31,109.9 243.81,109.4 238.81,109.4 238.56,109.15 238.56,107.15 238.31,106.9 233.81,106.9 233.56,107.15 233.56,109.65 233.31,109.9 228.56,109.9 ; 262.56,109.9 v1(262.56,110.02) 262.56,109.9 ; 262.56,109.9 271.81,109.9 272.06,109.65 272.06,107.15 272.31,106.9 276.31,106.9 276.56,107.15 276.56,109.15 276.81,109.4 282.31,109.4 282.81,109.9 284.06,109.9 v1(283.81,110.02) ; 194.56,109.9 193.31,109.9 192.81,109.4 187.81,109.4 187.56,109.15 187.56,107.15 187.31,106.9 182.81,106.9 182.56,107.15 182.56,109.65 182.31,109.9 177.56,109.9 ; 194.56,109.9 v1(194.56,110.02) 194.56,109.9 ; 228.56,109.9 v1(228.56,110.02) 228.56,109.9 ; v1(160.56,110.02) 160.56,109.9 165.31,109.9 165.56,109.65 165.56,107.15 165.81,106.9 170.31,106.9 170.56,107.15 170.56,109.15 170.81,109.4 175.81,109.4 176.31,109.9 177.56,109.9 ; 177.56,109.9 v1(177.56,110.02) 177.56,109.9
  Bottom Layer w0.254: D2_R.1 v1(177.56,110.02) ; D6_R.1 v1(245.56,110.02) ; D1_R.1 v1(160.56,110.02) ; D8_R.1 v1(283.81,110.02) ; D3_R.1 v1(194.56,110.02) ; D5_R.1 v1(228.56,110.02) ; D4_R.1 v1(211.56,110.02) ; D7_R.1 v1(262.56,110.02)
ROW1_L: length 181.6
  Top Layer w0.254: 40.95,92.9 46.2,92.9 46.45,92.65 46.45,90.15 46.7,89.9 50.7,89.9 50.95,90.15 50.95,92.15 51.2,92.4 56.7,92.4 57.2,92.9 58.45,92.9 ; 40.95,92.9 v1(41.2,93.02) 40.95,92.9 ; 40.95,92.9 40.2,92.9 39.7,92.4 34.2,92.4 33.95,92.15 33.95,90.15 33.7,89.9 29.7,89.9 29.45,90.15 29.45,92.65 29.2,92.9 19.95,92.9 v1(19.95,93.02) ; 75.45,92.9 74.2,92.9 73.7,92.4 68.2,92.4 67.95,92.15 67.95,90.15 67.7,89.9 63.7,89.9 63.45,90.15 63.45,92.65 63.2,92.9 58.45,92.9 ; 75.45,92.9 v1(75.2,93.02) 75.45,92.9 ; 75.45,92.9 80.2,92.9 80.45,92.65 80.45,90.15 80.7,89.9 84.7,89.9 84.95,90.15 84.95,92.15 85.2,92.4 90.7,92.4 91.2,92.9 92.45,92.9 ; 58.45,92.9 v1(58.2,93.02) 58.45,92.9 ; 92.45,92.9 v1(92.2,93.02) 92.45,92.9 ; 92.45,92.9 97.2,92.9 97.45,92.65 97.45,90.15 97.7,89.9 101.7,89.9 101.95,90.15 101.95,92.15 102.2,92.4 107.7,92.4 108.2,92.9 108.95,92.9 ; U1_L.7 104.95,114.4 108.2,114.4 108.45,114.65 108.45,119.15 108.7,119.4 114.7,119.4 115.2,119.9 120.2,119.9 120.45,119.65 120.45,105.65 120.2,105.4 115.7,105.4 115.45,105.15 115.45,104.65 115.2,104.4 111.2,104.4 110.95,104.15 110.95,100.15 110.7,99.9 109.2,99.9 108.95,99.65 108.95,92.9 ; 108.95,92.9 v1(109.2,93.02) 108.95,92.9
  Bottom Layer w0.254: D9_L.1 v1(41.2,93.02) ; D13_L.1 v1(109.2,93.02) ; D12_L.1 v1(92.2,93.02) ; D10_L.1 v1(58.2,93.02) ; D11_L.1 v1(75.2,93.02) ; D8_L.1 v1(19.95,93.02)
ROW1_R: length 266.7
  Top Layer w0.254: 288.06,92.9 v1(288.06,93.02) 288.06,92.9 ; 288.06,92.9 288.06,94.15 287.81,94.4 286.81,94.4 286.56,94.65 286.56,119.65 286.31,119.9 266.31,119.9 265.81,120.4 249.81,120.4 249.31,120.9 233.31,120.9 232.81,121.4 224.31,121.4 223.81,120.9 217.81,120.9 217.56,120.65 217.56,118.65 217.31,118.4 215.56,118.4 U1_R.4 ; 288.06,92.9 286.81,92.9 286.31,92.4 281.31,92.4 281.06,92.15 281.06,90.15 280.81,89.9 276.31,89.9 276.06,90.15 276.06,92.65 275.81,92.9 271.06,92.9 ; 220.06,92.9 224.81,92.9 225.06,92.65 225.06,90.15 225.31,89.9 229.81,89.9 230.06,90.15 230.06,92.15 230.31,92.4 235.31,92.4 235.81,92.9 237.06,92.9 ; 220.06,92.9 218.81,92.9 218.31,92.4 213.31,92.4 213.06,92.15 213.06,90.15 212.81,89.9 208.31,89.9 208.06,90.15 208.06,92.65 207.81,92.9 203.06,92.9 ; 220.06,92.9 v1(220.06,93.02) 220.06,92.9 ; 254.06,92.9 258.81,92.9 259.06,92.65 259.06,90.15 259.31,89.9 263.81,89.9 264.06,90.15 264.06,92.15 264.31,92.4 269.31,92.4 269.81,92.9 271.06,92.9 ; 254.06,92.9 v1(254.06,93.02) 254.06,92.9 ; 254.06,92.9 252.81,92.9 252.31,92.4 247.31,92.4 247.06,92.15 247.06,90.15 246.81,89.9 242.31,89.9 242.06,90.15 242.06,92.65 241.81,92.9 237.06,92.9 ; 237.06,92.9 v1(237.06,93.02) 237.06,92.9 ; 203.06,92.9 v1(203.06,93.02) 203.06,92.9 ; 203.06,92.9 201.81,92.9 201.31,92.4 196.31,92.4 196.06,92.15 196.06,90.15 195.81,89.9 191.31,89.9 191.06,90.15 191.06,92.65 190.81,92.9 186.06,92.9 ; 271.06,92.9 v1(271.06,93.02) 271.06,92.9 ; 186.06,92.9 v1(186.06,93.02) 186.06,92.9 ; 186.06,92.9 184.81,92.9 184.31,92.4 179.31,92.4 179.06,92.15 179.06,90.15 178.81,89.9 174.31,89.9 174.06,90.15 174.06,92.65 173.81,92.9 169.06,92.9 v1(169.06,93.02)
  Bottom Layer w0.254: D9_R.1 v1(169.06,93.02) ; D11_R.1 v1(203.06,93.02) ; D14_R.1 v1(254.06,93.02) ; D15_R.1 v1(271.06,93.02) ; D10_R.1 v1(186.06,93.02) ; D13_R.1 v1(237.06,93.02) ; D16_R.1 v1(288.06,93.02) ; D12_R.1 v1(220.06,93.02)
ROW2_L: length 197.6
  Top Layer w0.254: 45.45,75.9 50.2,75.9 50.45,75.65 50.45,73.15 50.7,72.9 55.2,72.9 55.45,73.15 55.45,75.15 55.7,75.4 60.7,75.4 61.2,75.9 62.45,75.9 ; 45.45,75.9 v1(45.45,76.02) 45.45,75.9 ; 45.45,75.9 44.2,75.9 43.7,75.4 38.7,75.4 38.45,75.15 38.45,73.15 38.2,72.9 33.7,72.9 33.45,73.15 33.45,75.65 33.2,75.9 21.95,75.9 v1(22.08,76.02) ; 79.45,75.9 78.2,75.9 77.7,75.4 72.7,75.4 72.45,75.15 72.45,73.15 72.2,72.9 67.7,72.9 67.45,73.15 67.45,75.65 67.2,75.9 62.45,75.9 ; 79.45,75.9 v1(79.45,76.02) 79.45,75.9 ; 79.45,75.9 84.2,75.9 84.45,75.65 84.45,73.15 84.7,72.9 89.2,72.9 89.45,73.15 89.45,75.15 89.7,75.4 94.7,75.4 95.2,75.9 96.45,75.9 ; 62.45,75.9 v1(62.45,76.02) 62.45,75.9 ; 113.45,75.9 v1(113.45,76.02) 113.45,75.9 ; 113.45,75.9 113.45,82.65 113.2,82.9 112.7,82.9 112.45,83.15 112.45,103.65 112.7,103.9 115.7,103.9 115.95,104.15 115.95,104.65 116.2,104.9 120.7,104.9 120.95,105.15 120.95,120.15 120.7,120.4 114.7,120.4 114.2,119.9 108.2,119.9 107.95,119.65 107.95,116.15 107.7,115.9 104.95,115.9 U1_L.6 ; 113.45,75.9 112.2,75.9 111.7,75.4 106.7,75.4 106.45,75.15 106.45,73.15 106.2,72.9 101.7,72.9 101.45,73.15 101.45,75.65 101.2,75.9 96.45,75.9 ; 96.45,75.9 v1(96.45,76.02) 96.45,75.9
  Bottom Layer w0.254: D16_L.1 v1(62.45,76.02) ; D17_L.1 v1(79.45,76.02) ; D14_L.1 v1(22.08,76.02) ; D18_L.1 v1(96.45,76.02) ; D19_L.1 v1(113.45,76.02) ; D15_L.1 v1(45.45,76.02)
ROW2_R: length 382.6
  Top Layer w0.254: 224.56,75.9 v1(224.31,76.02) 224.56,75.9 ; 224.56,75.9 229.31,75.9 229.56,75.65 229.56,73.15 229.81,72.9 233.81,72.9 234.06,73.15 234.06,75.15 234.31,75.4 239.81,75.4 240.31,75.9 241.06,75.9 ; 224.56,75.9 223.31,75.9 222.81,75.4 217.31,75.4 217.06,75.15 217.06,73.15 216.81,72.9 212.81,72.9 212.56,73.15 212.56,75.65 212.31,75.9 207.56,75.9 ; U1_R.3 215.56,119.4 216.81,119.4 217.06,119.65 217.06,121.15 217.31,121.4 223.31,121.4 223.81,121.9 233.31,121.9 233.81,121.4 249.81,121.4 250.31,120.9 266.31,120.9 266.81,120.4 286.81,120.4 287.06,120.15 287.06,103.15 287.31,102.9 290.31,102.9 290.56,102.65 290.56,88.65 290.31,88.4 286.31,88.4 286.06,88.15 286.06,87.65 285.56,87.15 285.56,32.15 285.31,31.9 284.31,31.9 284.06,31.65 284.06,24.9 ; 258.06,75.9 v1(258.31,76.02) 258.06,75.9 ; 258.06,75.9 269.81,75.9 270.06,75.65 270.06,73.15 270.31,72.9 274.31,72.9 274.56,73.15 274.56,75.15 274.81,75.4 280.31,75.4 280.81,75.9 281.56,75.9 ; 258.06,75.9 257.31,75.9 256.81,75.4 251.31,75.4 251.06,75.15 251.06,73.15 250.81,72.9 246.81,72.9 246.56,73.15 246.56,75.65 246.31,75.9 241.06,75.9 ; 190.56,75.9 195.31,75.9 195.56,75.65 195.56,73.15 195.81,72.9 199.81,72.9 200.06,73.15 200.06,75.15 200.31,75.4 205.81,75.4 206.31,75.9 207.56,75.9 ; 190.56,75.9 v1(190.31,76.02) 190.56,75.9 ; 190.56,75.9 189.31,75.9 188.81,75.4 183.31,75.4 183.06,75.15 183.06,73.15 182.81,72.9 178.81,72.9 178.56,73.15 178.56,75.65 178.31,75.9 173.06,75.9 v1(173.31,76.02) ; 281.56,75.9 v1(281.68,76.02) 281.56,75.9 ; 281.56,75.9 281.56,31.15 281.81,30.9 282.31,30.9 282.56,30.65 282.56,25.15 282.81,24.9 284.06,24.9 ; 284.06,24.9 v1(283.81,25.02) 284.06,24.9 ; 241.06,75.9 v1(241.31,76.02) 241.06,75.9 ; 207.56,75.9 v1(207.31,76.02) 207.56,75.9
  Bottom Layer w0.254: D19_R.1 v1(207.31,76.02) ; D22_R.1 v1(258.31,76.02) ; D20_R.1 v1(224.31,76.02) ; D21_R.1 v1(241.31,76.02) ; D18_R.1 v1(190.31,76.02) ; D23_R.1 v1(281.68,76.02) ; D24_R.1 v1(283.81,25.02) ; D17_R.1 v1(173.31,76.02)
ROW3_L: length 220.5
  Top Layer w0.254: 104.95,58.9 v1(104.95,59.02) 104.95,58.9 ; 104.95,58.9 109.7,58.9 109.95,58.65 109.95,56.15 110.2,55.9 114.7,55.9 114.95,56.15 114.95,58.15 115.2,58.4 120.2,58.4 120.7,58.9 121.95,58.9 ; 104.95,58.9 103.7,58.9 103.2,58.4 98.2,58.4 97.95,58.15 97.95,56.15 97.7,55.9 93.2,55.9 92.95,56.15 92.95,58.65 92.7,58.9 87.95,58.9 ; 87.95,58.9 v1(87.95,59.02) 87.95,58.9 ; 87.95,58.9 86.7,58.9 86.2,58.4 81.2,58.4 80.95,58.15 80.95,56.15 80.7,55.9 76.2,55.9 75.95,56.15 75.95,58.65 75.7,58.9 70.95,58.9 ; 53.95,58.9 v1(53.95,59.02) 53.95,58.9 ; 53.95,58.9 52.7,58.9 52.2,58.4 47.2,58.4 46.95,58.15 46.95,56.15 46.7,55.9 42.2,55.9 41.95,56.15 41.95,58.65 41.7,58.9 26.45,58.9 v1(26.33,59.02) ; 53.95,58.9 58.7,58.9 58.95,58.65 58.95,56.15 59.2,55.9 63.7,55.9 63.95,56.15 63.95,58.15 64.2,58.4 69.2,58.4 69.7,58.9 70.95,58.9 ; 70.95,58.9 v1(70.95,59.02) 70.95,58.9 ; 121.95,58.9 v1(121.95,59.02) 121.95,58.9 ; 121.95,58.9 121.95,65.65 121.7,65.9 121.2,65.9 120.95,66.15 120.95,71.65 119.45,73.15 119.45,87.65 118.2,88.9 116.7,88.9 114.95,90.65 114.95,103.15 115.2,103.4 116.2,103.4 116.45,103.65 116.45,104.15 116.7,104.4 121.2,104.4 121.45,104.65 121.45,120.65 121.2,120.9 114.2,120.9 113.7,120.4 107.7,120.4 107.45,120.15 107.45,117.15 107.2,116.9 104.95,116.9 U1_L.5
  Bottom Layer w0.254: D20_L.1 v1(26.33,59.02) ; D24_L.1 v1(104.95,59.02) ; D21_L.1 v1(53.95,59.02) ; D22_L.1 v1(70.95,59.02) ; D23_L.1 v1(87.95,59.02) ; D25_L.1 v1(121.95,59.02)
ROW3_R: length 411.2
  Top Layer w0.254: 216.06,58.9 214.81,58.9 214.31,58.4 208.81,58.4 208.56,58.15 208.56,56.15 208.31,55.9 204.31,55.9 204.06,56.15 204.06,58.65 203.81,58.9 199.06,58.9 ; 216.06,58.9 v1(215.81,59.02) 216.06,58.9 ; 216.06,58.9 220.81,58.9 221.06,58.65 221.06,56.15 221.31,55.9 225.31,55.9 225.56,56.15 225.56,58.15 225.81,58.4 231.31,58.4 231.81,58.9 233.06,58.9 ; 271.81,24.9 272.06,24.65 272.06,20.65 272.31,20.4 276.81,20.4 277.06,20.15 277.06,19.65 277.31,19.4 281.31,19.4 281.56,19.65 281.56,20.15 281.81,20.4 286.31,20.4 286.56,20.65 286.56,87.65 286.81,87.9 290.81,87.9 291.06,88.15 291.06,103.15 290.81,103.4 287.81,103.4 287.56,103.65 287.56,120.65 287.31,120.9 267.31,120.9 266.81,121.4 250.81,121.4 250.31,121.9 234.31,121.9 233.81,122.4 217.31,122.4 217.06,122.65 217.06,123.15 216.81,123.4 214.31,123.4 214.06,123.15 214.06,121.15 214.31,120.9 215.56,120.9 U1_R.2 ; 271.81,24.9 266.56,24.9 ; 271.81,24.9 272.06,25.15 272.06,26.15 272.31,26.4 275.81,26.4 276.06,26.65 276.06,30.65 276.31,30.9 277.31,30.9 277.56,31.15 277.56,58.9 ; 271.81,24.9 266.56,24.9 ; 249.56,58.9 v1(249.81,59.02) 249.56,58.9 ; 249.56,58.9 248.81,58.9 248.31,58.4 242.81,58.4 242.56,58.15 242.56,56.15 242.31,55.9 238.31,55.9 238.06,56.15 238.06,58.65 237.81,58.9 233.06,58.9 ; 249.56,58.9 265.31,58.9 265.56,58.65 265.56,56.15 265.81,55.9 269.81,55.9 270.06,56.15 270.06,58.15 270.31,58.4 275.81,58.4 276.31,58.9 277.56,58.9 ; 199.06,58.9 v1(198.81,59.02) 199.06,58.9 ; 199.06,58.9 197.81,58.9 197.31,58.4 191.81,58.4 191.56,58.15 191.56,56.15 191.31,55.9 187.31,55.9 187.06,56.15 187.06,58.65 186.81,58.9 182.06,58.9 ; 277.56,58.9 v1(277.43,59.02) 277.56,58.9 ; 233.06,58.9 v1(232.81,59.02) 233.06,58.9 ; 182.06,58.9 v1(181.81,59.02) 182.06,58.9 ; 182.06,58.9 180.81,58.9 180.31,58.4 174.81,58.4 174.56,58.15 174.56,56.15 174.31,55.9 170.31,55.9 170.06,56.15 170.06,58.65 169.81,58.9 165.06,58.9 v1(164.81,59.02) ; 266.56,24.9 v1(266.81,25.02) 266.56,24.9
  Bottom Layer w0.254: D29_R.1 v1(232.81,59.02) ; D31_R.1 v1(277.43,59.02) ; D32_R.1 v1(266.81,25.02) ; D27_R.1 v1(198.81,59.02) ; D25_R.1 v1(164.81,59.02) ; D30_R.1 v1(249.81,59.02) ; D26_R.1 v1(181.81,59.02) ; D28_R.1 v1(215.81,59.02)
ROW4_L: length 444.1
  Top Layer w0.254: 53.95,41.9 v1(53.95,42.02) 53.95,41.9 ; 53.95,41.9 58.7,41.9 58.95,41.65 58.95,39.15 59.2,38.9 63.7,38.9 63.95,39.15 63.95,41.15 64.2,41.4 69.2,41.4 69.7,41.9 70.95,41.9 ; 53.95,41.9 52.7,41.9 52.45,42.15 52.45,47.65 52.2,47.9 39.2,47.9 38.95,48.15 38.95,50.15 37.7,51.4 23.2,51.4 21.45,49.65 21.45,42.15 21.2,41.9 15.95,41.9 v1(15.7,42.02) ; 70.95,41.9 88.2,41.9 88.45,41.65 88.45,39.15 88.7,38.9 95.95,38.9 ; 70.95,41.9 v1(70.95,42.02) 70.95,41.9 ; 95.95,38.9 v1(95.92,39.15) 95.95,38.9 ; 95.95,38.9 95.95,36.65 96.2,36.4 109.2,36.4 109.45,36.15 109.45,33.15 109.7,32.9 113.2,32.9 113.45,32.65 113.45,32.15 113.7,31.9 116.45,31.9 ; U1_L.4 104.95,118.4 102.7,118.4 102.45,118.65 102.45,119.15 102.2,119.4 90.7,119.4 90.45,119.65 90.45,123.65 90.2,123.9 81.2,123.9 80.95,123.65 80.95,122.15 80.7,121.9 70.2,121.9 69.7,121.4 53.7,121.4 53.2,120.9 37.2,120.9 36.7,120.4 20.7,120.4 20.2,119.9 4.2,119.9 3.95,119.65 3.95,105.65 4.2,105.4 7.7,105.4 7.95,105.15 7.95,88.65 8.2,88.4 10.2,88.4 10.45,88.15 10.45,71.65 10.7,71.4 14.2,71.4 14.45,71.15 14.45,54.65 14.7,54.4 19.2,54.4 19.45,54.15 19.45,53.65 19.7,53.4 112.2,53.4 112.45,53.15 112.45,47.65 112.7,47.4 116.45,45.65 116.45,31.9 ; 116.45,31.9 v1(116.53,32.14) 116.45,31.9
  Bottom Layer w0.254: D26_L.1 v1(15.7,42.02) ; D27_L.1 v1(53.95,42.02) ; D30_L.1 v1(116.53,32.14) ; D28_L.1 v1(70.95,42.02) ; D29_L.1 v1(95.92,39.15)
ROW4_R: length 209.2
  Top Layer w0.254: 182.06,23.9 180.81,23.9 180.56,23.65 180.56,22.65 180.31,22.4 175.31,22.4 175.06,22.15 175.06,19.15 174.81,18.9 170.81,18.9 170.56,19.15 170.56,20.65 170.31,20.9 165.06,20.9 ; 182.06,23.9 182.06,30.15 182.56,30.65 182.56,41.65 182.31,41.9 182.06,41.9 ; 182.06,23.9 v1(182.2,23.71) 182.06,23.9 ; 233.06,41.9 v1(232.81,42.02) 233.06,41.9 ; 233.06,41.9 231.81,41.9 231.31,41.4 225.81,41.4 225.56,41.15 225.56,39.15 225.31,38.9 221.31,38.9 221.06,39.15 221.06,41.65 220.81,41.9 216.06,41.9 ; 233.06,41.9 254.81,41.9 255.06,41.65 255.06,39.15 255.31,38.9 259.31,38.9 259.56,39.15 259.56,41.15 259.81,41.4 265.31,41.4 265.81,41.9 266.56,41.9 ; 165.06,20.9 v1(165.2,20.74) 165.06,20.9 ; 165.06,20.9 163.81,20.9 163.56,20.65 163.56,19.65 163.31,19.4 158.31,19.4 158.06,19.15 158.06,16.15 157.81,15.9 153.81,15.9 153.56,16.15 153.56,17.65 153.31,17.9 148.06,17.9 v1(148.2,17.85) ; 182.06,41.9 v1(181.81,42.02) 182.06,41.9 ; 182.06,41.9 203.81,41.9 204.06,41.65 204.06,39.15 204.31,38.9 208.31,38.9 208.56,39.15 208.56,41.15 208.81,41.4 214.31,41.4 214.81,41.9 216.06,41.9 ; 216.06,41.9 v1(215.81,42.02) 216.06,41.9 ; v1(249.81,25.02) 249.56,24.9 254.81,24.9 255.06,25.15 255.06,26.15 255.31,26.4 258.81,26.4 259.06,26.65 259.06,30.65 259.31,30.9 265.81,30.9 266.06,31.15 266.06,34.15 266.56,34.65 266.56,41.9 ; 266.56,41.9 v1(266.81,42.02) 266.56,41.9
  Bottom Layer w0.254: D33_R.1 v1(148.2,17.85) ; D39_R.1 v1(266.81,42.02) ; D40_R.1 v1(249.81,25.02) ; D37_R.1 v1(215.81,42.02) ; D36_R.1 v1(181.81,42.02) ; D38_R.1 v1(232.81,42.02) ; D34_R.1 v1(165.2,20.74) ; D35_R.1 v1(182.2,23.71)
SW1_2_L: length 9.1
  Bottom Layer w0.254: SW1_L.2 14.55,106.75 14.55,114.48 14.8,114.73 D1_L.2
SW1_2_R: length 9.1
  Bottom Layer w0.254: D1_R.2 159.66,114.73 159.41,114.48 159.41,106.75 SW1_R.2
SW2_2_L: length 9.1
  Bottom Layer w0.254: D2_L.2 31.8,114.73 31.55,114.48 31.55,106.75 SW2_L.2
SW2_2_R: length 9.1
  Bottom Layer w0.254: D2_R.2 176.66,114.73 176.41,114.48 176.41,106.75 SW2_R.2
SW3_2_L: length 9.1
  Bottom Layer w0.254: D3_L.2 48.8,114.73 48.55,114.48 48.55,106.75 SW3_L.2
SW3_2_R: length 9.1
  Bottom Layer w0.254: D3_R.2 193.66,114.73 193.41,114.48 193.41,106.75 SW3_R.2
SW4_2_L: length 9.1
  Bottom Layer w0.254: D4_L.2 65.8,114.73 65.55,114.48 65.55,106.75 SW4_L.2
SW4_2_R: length 9.1
  Bottom Layer w0.254: D4_R.2 210.66,114.73 210.41,114.48 210.41,106.75 SW4_R.2
SW5_2_L: length 9.1
  Bottom Layer w0.254: SW5_L.2 82.55,106.75 82.55,114.48 82.8,114.73 D5_L.2
SW5_2_R: length 9.1
  Bottom Layer w0.254: SW5_R.2 227.41,106.75 227.41,114.48 227.66,114.73 D5_R.2
SW6_2_L: length 9.1
  Bottom Layer w0.254: D6_L.2 99.8,114.73 99.55,114.48 99.55,106.75 SW6_L.2
SW6_2_R: length 9.1
  Bottom Layer w0.254: D6_R.2 244.66,114.73 244.41,114.48 244.41,106.75 SW6_R.2
SW7_2_L: length 9.1
  Bottom Layer w0.254: D7_L.2 116.8,114.73 116.55,114.48 116.55,106.75 SW7_L.2
SW7_2_R: length 9.1
  Bottom Layer w0.254: D7_R.2 261.66,114.73 261.41,114.48 261.41,106.75 SW7_R.2
SW8_2_L: length 9.1
  Bottom Layer w0.254: SW8_L.2 18.8,89.75 18.8,97.48 19.05,97.73 D8_L.2
SW8_2_R: length 9.1
  Bottom Layer w0.254: SW8_R.2 282.66,106.75 282.66,114.48 282.91,114.73 D8_R.2
SW9_2_L: length 9.1
  Bottom Layer w0.254: D9_L.2 40.3,97.73 40.05,97.48 40.05,89.75 SW9_L.2
SW9_2_R: length 9.1
  Bottom Layer w0.254: SW9_R.2 167.91,89.75 167.91,97.48 168.16,97.73 D9_R.2
SW10_2_L: length 9.1
  Bottom Layer w0.254: D10_L.2 57.3,97.73 57.05,97.48 57.05,89.75 SW10_L.2
SW10_2_R: length 9.1
  Bottom Layer w0.254: D10_R.2 185.16,97.73 184.91,97.48 184.91,89.75 SW10_R.2
SW11_2_L: length 9.1
  Bottom Layer w0.254: SW11_L.2 74.05,89.75 74.05,97.48 74.3,97.73 D11_L.2
SW11_2_R: length 9.1
  Bottom Layer w0.254: SW11_R.2 201.91,89.75 201.91,97.48 202.16,97.73 D11_R.2
SW12_2_L: length 9.1
  Bottom Layer w0.254: D12_L.2 91.3,97.73 91.05,97.48 91.05,89.75 SW12_L.2
SW12_2_R: length 9.1
  Bottom Layer w0.254: SW12_R.2 218.91,89.75 218.91,97.48 219.16,97.73 D12_R.2
SW13_2_L: length 9.1
  Bottom Layer w0.254: D13_L.2 108.3,97.73 108.05,97.48 108.05,89.75 SW13_L.2
SW13_2_R: length 9.1
  Bottom Layer w0.254: D13_R.2 236.16,97.73 235.91,97.48 235.91,89.75 SW13_R.2
SW14_2_L: length 9.1
  Bottom Layer w0.254: SW14_L.2 20.92,72.75 20.92,80.48 21.18,80.73 D14_L.2
SW14_2_R: length 9.1
  Bottom Layer w0.254: SW14_R.2 252.91,89.75 252.91,97.48 253.16,97.73 D14_R.2
SW15_2_L: length 9.1
  Bottom Layer w0.254: D15_L.2 44.55,80.73 44.3,80.48 44.3,72.75 SW15_L.2
SW15_2_R: length 9.1
  Bottom Layer w0.254: SW15_R.2 269.91,89.75 269.91,97.48 270.16,97.73 D15_R.2
SW16_2_L: length 9.1
  Bottom Layer w0.254: SW16_L.2 61.3,72.75 61.3,80.48 61.55,80.73 D16_L.2
SW16_2_R: length 9.1
  Bottom Layer w0.254: D16_R.2 287.16,97.73 286.91,97.48 286.91,89.75 SW16_R.2
SW17_2_L: length 9.1
  Bottom Layer w0.254: D17_L.2 78.55,80.73 78.3,80.48 78.3,72.75 SW17_L.2
SW17_2_R: length 9.1
  Bottom Layer w0.254: SW17_R.2 172.16,72.75 172.16,80.48 172.41,80.73 D17_R.2
SW18_2_L: length 9.1
  Bottom Layer w0.254: SW18_L.2 95.3,72.75 95.3,80.48 95.55,80.73 D18_L.2
SW18_2_R: length 9.1
  Bottom Layer w0.254: SW18_R.2 189.16,72.75 189.16,80.48 189.41,80.73 D18_R.2
SW19_2_L: length 9.1
  Bottom Layer w0.254: SW19_L.2 112.3,72.75 112.3,80.48 112.55,80.73 D19_L.2
SW19_2_R: length 9.1
  Bottom Layer w0.254: D19_R.2 206.41,80.73 206.16,80.48 206.16,72.75 SW19_R.2
SW20_2_L: length 9.1
  Bottom Layer w0.254: SW20_L.2 25.17,55.75 25.17,63.48 25.43,63.73 D20_L.2
SW20_2_R: length 9.1
  Bottom Layer w0.254: SW20_R.2 223.16,72.75 223.16,80.48 223.41,80.73 D20_R.2
SW21_2_L: length 9.1
  Bottom Layer w0.254: SW21_L.2 52.8,55.75 52.8,63.48 53.05,63.73 D21_L.2
SW21_2_R: length 9.1
  Bottom Layer w0.254: SW21_R.2 240.16,72.75 240.16,80.48 240.41,80.73 D21_R.2
SW22_2_L: length 9.1
  Bottom Layer w0.254: D22_L.2 70.05,63.73 69.8,63.48 69.8,55.75 SW22_L.2
SW22_2_R: length 9.1
  Bottom Layer w0.254: D22_R.2 257.41,80.73 257.16,80.48 257.16,72.75 SW22_R.2
SW23_2_L: length 9.1
  Bottom Layer w0.254: SW23_L.2 86.8,55.75 86.8,63.48 87.05,63.73 D23_L.2
SW23_2_R: length 9.1
  Bottom Layer w0.254: SW23_R.2 280.53,72.75 280.53,80.48 280.78,80.73 D23_R.2
SW24_2_L: length 9.1
  Bottom Layer w0.254: SW24_L.2 103.8,55.75 103.8,63.48 104.05,63.73 D24_L.2
SW24_2_R: length 9.1
  Bottom Layer w0.254: SW24_R.2 282.66,21.75 282.66,29.48 282.91,29.73 D24_R.2
SW25_2_L: length 9.1
  Bottom Layer w0.254: D25_L.2 121.05,63.73 120.8,63.48 120.8,55.75 SW25_L.2
SW25_2_R: length 9.1
  Bottom Layer w0.254: SW25_R.2 163.66,55.75 163.66,63.48 163.91,63.73 D25_R.2
SW26_2_L: length 9.1
  Bottom Layer w0.254: SW26_L.2 14.55,38.75 14.55,46.48 14.8,46.73 D26_L.2
SW26_2_R: length 9.1
  Bottom Layer w0.254: SW26_R.2 180.66,55.75 180.66,63.48 180.91,63.73 D26_R.2
SW27_2_L: length 9.1
  Bottom Layer w0.254: SW27_L.2 52.8,38.75 52.8,46.48 53.05,46.73 D27_L.2
SW27_2_R: length 9.1
  Bottom Layer w0.254: SW27_R.2 197.66,55.75 197.66,63.48 197.91,63.73 D27_R.2
SW28_2_L: length 9.1
  Bottom Layer w0.254: SW28_L.2 69.8,38.75 69.8,46.48 70.05,46.73 D28_L.2
SW28_2_R: length 9.1
  Bottom Layer w0.254: SW28_R.2 214.66,55.75 214.66,63.48 214.91,63.73 D28_R.2
SW29_2_L: length 9.1
  Bottom Layer w0.254: D29_L.2 95.86,43.95 95.56,43.75 94.22,36.13 94.35,36.11
SW29_2_R: length 9.1
  Bottom Layer w0.254: D29_R.2 231.91,63.73 231.66,63.48 231.66,55.75 SW29_R.2
SW30_2_L: length 9.1
  Bottom Layer w0.254: 114.45,29.42 114.33,29.46 116.97,36.72 117.3,36.88 118.14,36.57
SW30_2_R: length 9.1
  Bottom Layer w0.254: D30_R.2 248.91,63.73 248.66,63.48 248.66,55.75 SW30_R.2
SW31_2_R: length 9.1
  Bottom Layer w0.254: D31_R.2 276.53,63.73 276.28,63.48 276.28,55.75 SW31_R.2
SW32_2_R: length 9.1
  Bottom Layer w0.254: SW32_R.2 265.66,21.75 265.66,29.48 265.91,29.73 D32_R.2
SW33_2_R: length 9.1
  Bottom Layer w0.254: 147.38,22.49 146.49,22.34 146.29,22.04 147.63,14.43 147.75,14.45
SW34_2_R: length 9.1
  Bottom Layer w0.254: SW34_R.2 164.63,17.32 163.29,24.93 163.49,25.23 164.38,25.38
SW35_2_R: length 9.1
  Bottom Layer w0.254: 181.38,28.36 180.49,28.2 180.29,27.91 181.63,20.3 SW35_R.2
SW36_2_R: length 9.1
  Bottom Layer w0.254: D36_R.2 180.91,46.73 180.66,46.48 180.66,38.75 SW36_R.2
SW37_2_R: length 9.1
  Bottom Layer w0.254: D37_R.2 214.91,46.73 214.66,46.48 214.66,38.75 SW37_R.2
SW38_2_R: length 9.1
  Bottom Layer w0.254: SW38_R.2 231.66,38.75 231.66,46.48 231.91,46.73 D38_R.2
SW39_2_R: length 9.1
  Bottom Layer w0.254: D39_R.2 265.91,46.73 265.66,46.48 265.66,38.75 SW39_R.2
SW40_2_R: length 9.1
  Bottom Layer w0.254: SW40_R.2 248.66,21.75 248.66,29.48 248.91,29.73 D40_R.2
